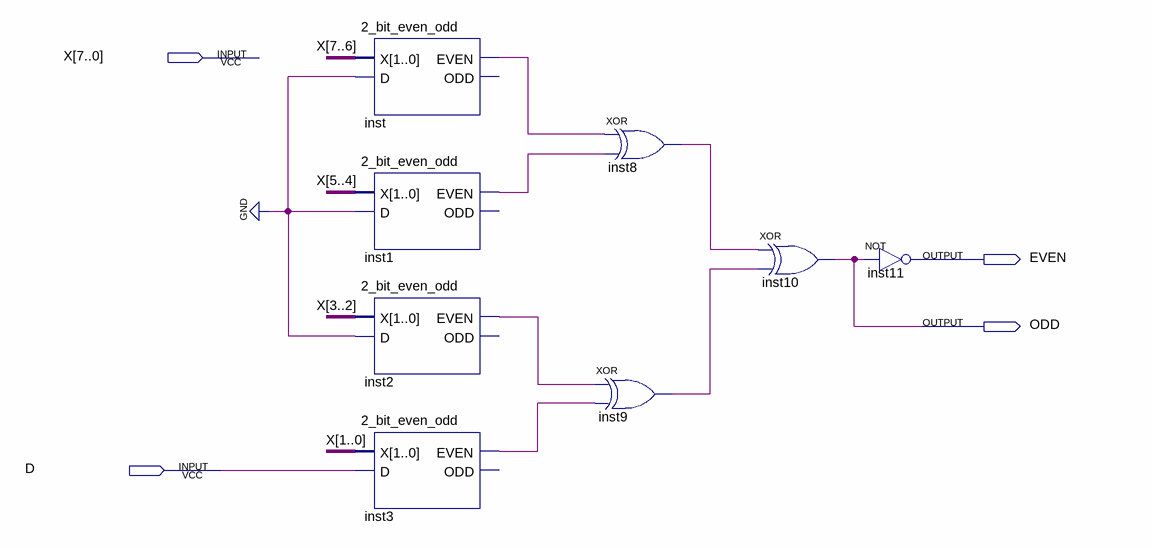
[diagram p0: schematic sheet]
// Quartus schematic 8_bit_even_odd.bdf as structural Verilog: 8 symbols, 4 pins
module \8_bit_even_odd  (
  input  [7:0] X,
  input  D,
  output EVEN,
  output ODD
);

  wire inst1_even, inst2_even, inst3_even, inst8_out, inst9_out, inst_even;

  \2_bit_even_odd  inst (.X(X[7:6]), .D(1'b0), .EVEN(inst_even));  // open: ODD
  \2_bit_even_odd  inst1 (.X(X[5:4]), .D(1'b0), .EVEN(inst1_even));  // open: ODD
  \2_bit_even_odd  inst2 (.X(X[3:2]), .D(1'b0), .EVEN(inst2_even));  // open: ODD
  \2_bit_even_odd  inst3 (.X(X[1:0]), .D(D), .EVEN(inst3_even));  // open: ODD
  xor inst8 (inst8_out, inst_even, inst1_even);
  xor inst9 (inst9_out, inst2_even, inst3_even);
  xor inst10 (ODD, inst8_out, inst9_out);
  not inst11 (EVEN, ODD);
endmodule
